# Altium project reverse_pol_protection.PrjPcb
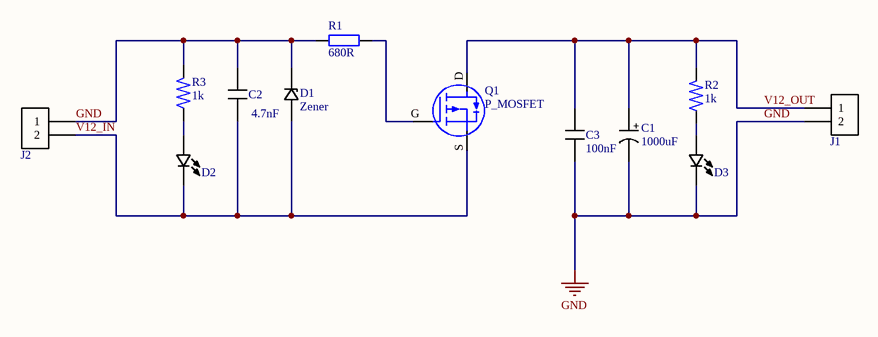
[diagram p0: reverse_pol_protection.SchDoc]
1 sheet, 12 parts. Net scope: global (net labels, ports and power ports of the same name join across sheets).
Board file: reverse_pol_protection.PcbDoc

## Sheet reverse_pol_protection.SchDoc
size A4; SheetNumber: 1; SheetTotal: 1

### Parts
C1  1000uF  [RUBYCON_CAP_12.5x25]
C2  4.7nF  [YAGEO_CAP_0805_EA]
C3  100nF  [YAGEO_CAP_0805_E0]
D1  Zener  [NEXPERIA_DO-41]
D2  LED  [KINGBRIGHT_LED_THT_H4.9]  (value not drawn)
D3  LED  [KINGBRIGHT_LED_THT_H4.9]  (value not drawn)
J1  ?  [KEFA_TERMINAL_2POS]  (value not drawn)
J2  ?  [KEFA_TERMINAL_2POS]  (value not drawn)
Q1  P_MOSFET  [INFINEON_TO220-3]
R1  680R  [YAGEO_RES_THT_P12.5]
R2  1k  [Yageo_RES_0805]
R3  1k  [Yageo_RES_0805]

### Nets
GND: C1.2 C2.2 C3.1 D1.K(Cathode) D3.K(Cathode) J1.2 J2.1 R1.1 R3.2
V12_IN: C2.1 D1.A(Anode) D2.K(Cathode) J2.2 Q1.S(Source)
V12_OUT: C1.1 C3.2 J1.1 Q1.D(Drain) R2.2
NetD2_A: D2.A(Anode) R3.1
NetD3_A: D3.A(Anode) R2.1
NetQ1_G: Q1.G(Gate) R1.2

### Notes on the sheet
- (in symbol Cap_Elec) +

### Library data of the parts
C1 = Cap_Elec: Generic Electrolytic Capacitor
C2 C3 = Cap_Ceramic: Generic Ceramic Capacitor
D1 = Zener: Generic Zener Diode
D2 D3 = LED: Generic Light Emitting Diode, Circuit indication
J1 J2 = Terminal Block: Generic 2 position terminal block
Q1 = P_MOSFET: Infineon P-Channel MOSFET
R1 = Resistor_L: Generic Resistor, Power > 1W
R2 R3 = Resistor_S: Generic Resistor, Power <= 1W